# Altium schematic sheet FPGA RAM.SchDoc
size B; SheetNumber: 3; SheetTotal: 5
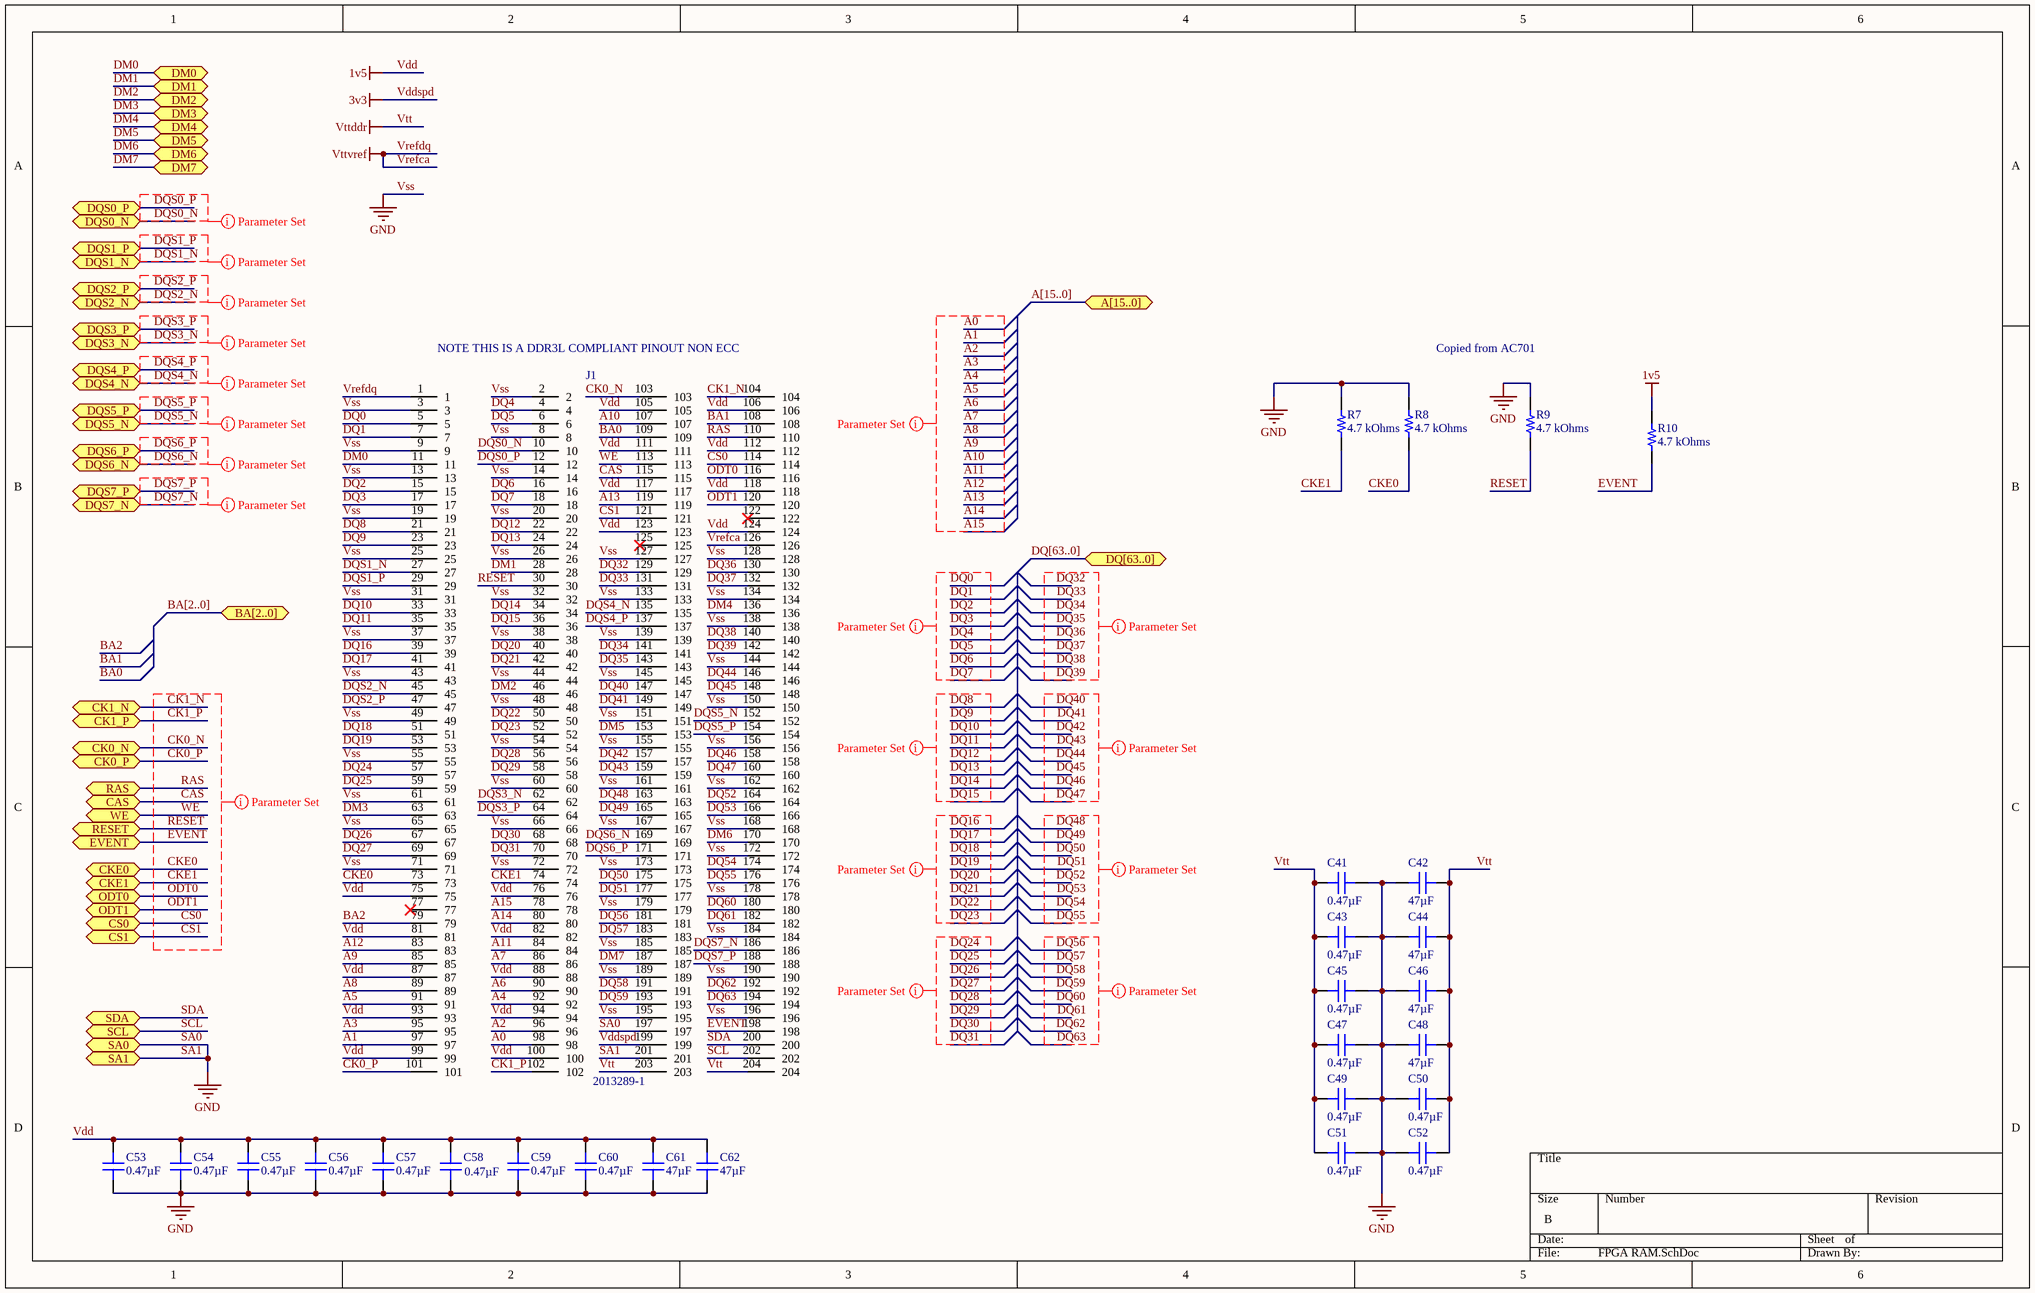
[diagram p0: FPGA RAM.SchDoc]

## Parts
C41  0.47µF  [CAP 0603_1608]
C42  47µF  [CAP 0805_2012]
C43  0.47µF  [CAP 0603_1608]
C44  47µF  [CAP 0805_2012]
C45  0.47µF  [CAP 0603_1608]
C46  47µF  [CAP 0805_2012]
C47  0.47µF  [CAP 0603_1608]
C48  47µF  [CAP 0805_2012]
C49  0.47µF  [CAP 0603_1608]
C50  0.47µF  [CAP 0603_1608]
C51  0.47µF  [CAP 0603_1608]
C52  0.47µF  [CAP 0603_1608]
C53  0.47µF  [CAP 0603_1608]
C54  0.47µF  [CAP 0603_1608]
C55  0.47µF  [CAP 0603_1608]
C56  0.47µF  [CAP 0603_1608]
C57  0.47µF  [CAP 0603_1608]
C58  0.47µF  [CAP 0603_1608]
C59  0.47µF  [CAP 0603_1608]
C60  0.47µF  [CAP 0603_1608]
C61  47µF  [CAP 0805_2012]
C62  47µF  [CAP 0805_2012]
J1  2013289-1  [TE_2013289-1]
R7  4.7 kOhms  [RES 0603_1608]
R8  4.7 kOhms  [RES 0603_1608]
R9  4.7 kOhms  [RES 0603_1608]
R10  4.7 kOhms  [RES 0603_1608]

## Ports
A[15..0] (bidir), BA[2..0] (bidir), CAS (bidir), CK0_N (bidir), CK0_P (bidir), CK1_N (bidir), CK1_P (bidir), CKE0 (bidir), CKE1 (bidir), CS0 (bidir), CS1 (bidir), DM0 (bidir), DM1 (bidir), DM2 (bidir), DM3 (bidir), DM4 (bidir), DM5 (bidir), DM6 (bidir), DM7 (bidir), DQ[63..0] (bidir), DQS0_N (bidir), DQS0_P (bidir), DQS1_N (bidir), DQS1_P (bidir), DQS2_N (bidir), DQS2_P (bidir), DQS3_N (bidir), DQS3_P (bidir), DQS4_N (bidir), DQS4_P (bidir), DQS5_N (bidir), DQS5_P (bidir), DQS6_N (bidir), DQS6_P (bidir), DQS7_N (bidir), DQS7_P (bidir), EVENT (bidir), ODT0 (bidir), ODT1 (bidir), RAS (bidir), RESET (bidir), SA0 (bidir), SA1 (bidir), SCL (bidir), SDA (bidir), WE (bidir)

## Nets
SA0: C41.1 C42.2 C43.1 C44.2 C45.1 C46.2 C47.1 C48.2 C49.1 C50.2 C51.1 C52.2 C53.1 C54.1 C55.1 C56.1 C57.1 C58.1 C59.1 C60.1 C61.1 C62.1 J1.2 J1.3 J1.8 J1.9 J1.13 J1.14 J1.19 J1.20 J1.25 J1.26 J1.31 J1.32 J1.37 J1.38 J1.43 J1.44 J1.48 J1.49 J1.54 J1.55 J1.60 J1.61 J1.65 J1.66 J1.71 J1.72 J1.127 J1.128 J1.133 J1.134 J1.138 J1.139 J1.144 J1.145 J1.150 J1.151 J1.155 J1.156 J1.161 J1.162 J1.167 J1.168 J1.172 J1.173 J1.178 J1.179 J1.184 J1.185 J1.189 J1.190 J1.195 J1.196 J1.197 J1.201 R7.2 R8.2 R9.2 ; port SA0, port SA1  [also labelled GND, SA1, Vss]
Vdd: C53.2 C54.2 C55.2 C56.2 C57.2 C58.2 C59.2 C60.2 C61.2 C62.2 J1.75 J1.76 J1.81 J1.82 J1.87 J1.88 J1.93 J1.94 J1.99 J1.100 J1.105 J1.106 J1.111 J1.112 J1.117 J1.118 J1.123 J1.124 R10.2  [also labelled 1v5]
Vddspd: J1.199  [also labelled 3v3]
Vrefca: J1.1 J1.126  [also labelled Vrefdq, Vttvref]
Vtt: C41.2 C42.1 C43.2 C44.1 C45.2 C46.1 C47.2 C48.1 C49.2 C50.1 C51.2 C52.1 J1.203 J1.204  [also labelled Vttddr]
A0: J1.98
A1: J1.97
A2: J1.96
A3: J1.95
A4: J1.92
A5: J1.91
A6: J1.90
A7: J1.86
A8: J1.89
A9: J1.85
A10: J1.107
A11: J1.84
A12: J1.83
A13: J1.119
A14: J1.80
A15: J1.78
BA0: J1.109
BA1: J1.108
BA2: J1.79
CAS: J1.115 ; port CAS
CK0_N: J1.103 ; port CK0_N
CK0_P: J1.101 ; port CK0_P
CK1_N: J1.104 ; port CK1_N
CK1_P: J1.102 ; port CK1_P
CKE0: J1.73 R8.1 ; port CKE0
CKE1: J1.74 R7.1 ; port CKE1
CS0: J1.114 ; port CS0
CS1: J1.121 ; port CS1
DM0: J1.11 ; port DM0
DM1: J1.28 ; port DM1
DM2: J1.46 ; port DM2
DM3: J1.63 ; port DM3
DM4: J1.136 ; port DM4
DM5: J1.153 ; port DM5
DM6: J1.170 ; port DM6
DM7: J1.187 ; port DM7
DQ0: J1.5
DQ1: J1.7
DQ2: J1.15
DQ3: J1.17
DQ4: J1.4
DQ5: J1.6
DQ6: J1.16
DQ7: J1.18
DQ8: J1.21
DQ9: J1.23
DQ10: J1.33
DQ11: J1.35
DQ12: J1.22
DQ13: J1.24
DQ14: J1.34
DQ15: J1.36
DQ16: J1.39
DQ17: J1.41
DQ18: J1.51
DQ19: J1.53
DQ20: J1.40
DQ21: J1.42
DQ22: J1.50
DQ23: J1.52
DQ24: J1.57
DQ25: J1.59
DQ26: J1.67
DQ27: J1.69
DQ28: J1.56
DQ29: J1.58
DQ30: J1.68
DQ31: J1.70
DQ32: J1.129
DQ33: J1.131
DQ34: J1.141
DQ35: J1.143
DQ36: J1.130
DQ37: J1.132
DQ38: J1.140
DQ39: J1.142
DQ40: J1.147
DQ41: J1.149
DQ42: J1.157
DQ43: J1.159
DQ44: J1.146
DQ45: J1.148
DQ46: J1.158
DQ47: J1.160
DQ48: J1.163
DQ49: J1.165
DQ50: J1.175
DQ51: J1.177
DQ52: J1.164
DQ53: J1.166
DQ54: J1.174
DQ55: J1.176
DQ56: J1.181
DQ57: J1.183
DQ58: J1.191
DQ59: J1.193
DQ60: J1.180
DQ61: J1.182
DQ62: J1.192
DQ63: J1.194
DQS0_N: J1.10 ; port DQS0_N
DQS0_P: J1.12 ; port DQS0_P
DQS1_N: J1.27 ; port DQS1_N
DQS1_P: J1.29 ; port DQS1_P
DQS2_N: J1.45 ; port DQS2_N
DQS2_P: J1.47 ; port DQS2_P
DQS3_N: J1.62 ; port DQS3_N
DQS3_P: J1.64 ; port DQS3_P
DQS4_N: J1.135 ; port DQS4_N
DQS4_P: J1.137 ; port DQS4_P
DQS5_N: J1.152 ; port DQS5_N
DQS5_P: J1.154 ; port DQS5_P
DQS6_N: J1.169 ; port DQS6_N
DQS6_P: J1.171 ; port DQS6_P
DQS7_N: J1.186 ; port DQS7_N
DQS7_P: J1.188 ; port DQS7_P
EVENT: J1.198 R10.1 ; port EVENT
ODT0: J1.116 ; port ODT0
ODT1: J1.120 ; port ODT1
RAS: J1.110 ; port RAS
RESET: J1.30 R9.1 ; port RESET
SCL: J1.202 ; port SCL
SDA: J1.200 ; port SDA
WE: J1.113 ; port WE

Not connected (* = marked no-connect by the designer): J1 77* 122* 125*

## Buses and harness runs
bus A[15..0] = port A[15..0]
bus BA[2..0] = port BA[2..0]
bus DQ[63..0] = port DQ[63..0]

## Layout directives
net class DG_0: DQ0, DQ1, DQ2, DQ3, DQ4, DQ5, DQ6, DQ7, DQS0_N, DQS0_P
net class DG_1: DQ8, DQ9, DQ10, DQ11, DQ12, DQ13, DQ14, DQ15, DQS1_N, DQS1_P
net class DG_2: DQ16, DQ17, DQ18, DQ19, DQ20, DQ21, DQ22, DQ23, DQS2_N, DQS2_P
net class DG_3: DQ24, DQ25, DQ26, DQ27, DQ28, DQ29, DQ30, DQ31, DQS3_N, DQS3_P
net class DG_7: DQ56, DQ57, DQ58, DQ59, DQ60, DQ61, DQ62, DQ63, DQS7_N, DQS7_P
net class DG_6: DQ48, DQ49, DQ50, DQ51, DQ52, DQ53, DQ54, DQ55, DQS6_N, DQS6_P
net class DG_5: DQ40, DQ41, DQ42, DQ43, DQ44, DQ45, DQ46, DQ47, DQS5_N, DQS5_P
net class DG_4: DQ32, DQ33, DQ34, DQ35, DQ36, DQ37, DQ38, DQ39, DQS4_N, DQS4_P
net class CG: A0, A1, A2, A3, A4, A5, A6, A7, A8, A9, A10, A11, A12, A13, A14, A15, CAS, CK0_N, CK0_P, CK1_N, CK1_P, CKE0, CKE1, CS0, CS1, EVENT, ODT0, ODT1, RAS, RESET, WE

## Notes on the sheet
- (near J1) NOTE THIS IS A DDR3L COMPLIANT PINOUT NON ECC
- Copied from AC701

## Library data of the parts
C41 C43 C45 C47 C49-C60 = 885012106015: CAP CER 0.47UF 16V X5R 0603; Manufacturer: Würth Elektronik; Tolerance: ±20%; Part Number: 885012106015; Value: 0.47µF; Applications: General Purpose; Capacitance: 0.47µF; ComponentLink1Description: Datasheet; ComponentLink1URL: https://katalog.we-online.de/pbs/datasheet/885012106015.pdf; ComponentLink2Description: DigiKey Link; ComponentLink2URL: http://digikey.com/product-detail/en/w-rth-elektronik/885012106015/732-7912-1-ND/5454539; Device Package: 0603 (1608 Metric); LastUpdated: 2020-09-02 1:03:18 AM; Lifecycle Status: Active; Minimum Order: 1; Mounting Type: Surface Mount, MLCC; Operating Temperature: -55°C ~ 85°C; Package / Case: 0603 (1608 Metric); Packaging: TapeAndReel; PartId: 11963; Part Status: Active; Price: 0.04; Series: WCAP-CSGP; Size / Dimension: 0.063" L x 0.031" W (1.60mm x 0.80mm); Supplier 1: DigiKey; Supplier Part Number 1: 732-7912-1-ND; Temperature Coefficient: X5R; Thickness (Max): 0.037" (0.95mm); Voltage - Rated: 16V
C42 C44 C46 C48 C61 C62 = GRM21BR61A476ME15L: CAP CER 47UF 10V X5R 0805; Manufacturer: Murata Electronics; Tolerance: ±20%; Part Number: GRM21BR61A476ME15L; Value: 47µF; Applications: General Purpose; Capacitance: 47µF; ComponentLink1Description: Datasheet; ComponentLink1URL: https://search.murata.co.jp/Ceramy/image/img/A01X/G101/ENG/GRM21BR61A476ME15-01.pdf; ComponentLink2Description: DigiKey Link; ComponentLink2URL: http://digikey.com/product-detail/en/murata-electronics/GRM21BR61A476ME15L/490-9961-1-ND/5026442; Device Package: 0805 (2012 Metric); LastUpdated: 2020-09-02 1:04:38 AM; Lifecycle Status: Active; Minimum Order: 1; Mounting Type: Surface Mount, MLCC; Operating Temperature: -55°C ~ 85°C; Package / Case: 0805 (2012 Metric); Packaging: TapeAndReel; PartId: 4627; Part Status: Active; Price: 0.19; Series: GRM; Size / Dimension: 0.079" L x 0.049" W (2.00mm x 1.25mm); Supplier 1: DigiKey; Supplier Part Number 1: 490-9961-1-ND; Temperature Coefficient: X5R; Thickness (Max): 0.057" (1.45mm); Voltage - Rated: 10V
J1 = 2013289-1: 204 Position 0.6 mm Pitch Right Angle Surface Mount Socket DIMM Connector; Number_of_Positions: 204; MF: TE Connectivity; Centerline_Pitch: .6 mm[.024 in]; Product_Type: Socket; Package: None; Digi-Key_Purchase_URL: https://www.digikey.com/product-detail/en/te-connectivity-amp-connectors/2013289-1/A115021-ND/2135546?utm_source=snapeda&utm_medium=aggregator&utm_campaign=symbol; Digi-Key_Part_Number: A115021-ND; SnapEDA_Link: https://www.snapeda.com/parts/2013289-1/TE%20Connectivity%20AMP%20Connectors/view-part/231016/?ref=snap; MP: 2013289-1; TE_purchase_URL: https://www.te.com/usa-en/product-2013289-1.html?te_bu=Cor&te_type=disp&te_campaign=seda_glo_cor-seda-global-disp-prtnr-fy19-seda-model-bom-cta_sma-317_1&elqCampaignId=32493; Value: *
R7-R10 = RC0603FR-074K7L: RES 4.7K OHM 1% 1/10W 0603; Manufacturer: Yageo; Power (Watts): 0.1W, 1/10W; Temperature Coefficient: ±100ppm/°C; Part Number: RC0603FR-074K7L; Value: 4.7 kOhms; ComponentLink1Description: Datasheet; ComponentLink1URL: https://www.yageo.com/upload/media/product/productsearch/datasheet/rchip/PYu-RC_Group_51_RoHS_L_10.pdf; ComponentLink2Description: DigiKey Link; ComponentLink2URL: https://www.digikey.com/en/products/detail/yageo/RC0603FR-074K7L/727212; Composition: Thick Film; Device Package: 0603 (1608 Metric); Features: Moisture Resistant; Height - Seated (Max): 0.022" (0.55mm); LastUpdated: 2023-09-28 7:33:40 PM; Lifecycle Status: Active; Minimum Order: 1; Number of Terminations: 2; Operating Temperature: -55°C ~ 155°C; Package / Case: 0603 (1608 Metric); Packaging: CutTape; PartId: 23949; Part Status: Active; Price: 0.01; Resistance: 4.7 kOhms; Series: RC_L; Size / Dimension: 0.063" L x 0.031" W (1.60mm x 0.80mm); Supplier 1: DigiKey; Supplier Part Number 1: 311-4.70KHRCT-ND; Supplier Device Package: 0603; Tolerance: ±1%